# Altium schematic sheet mew-0.2.1-full-tsc.schdoc
size 341 x 243 mm
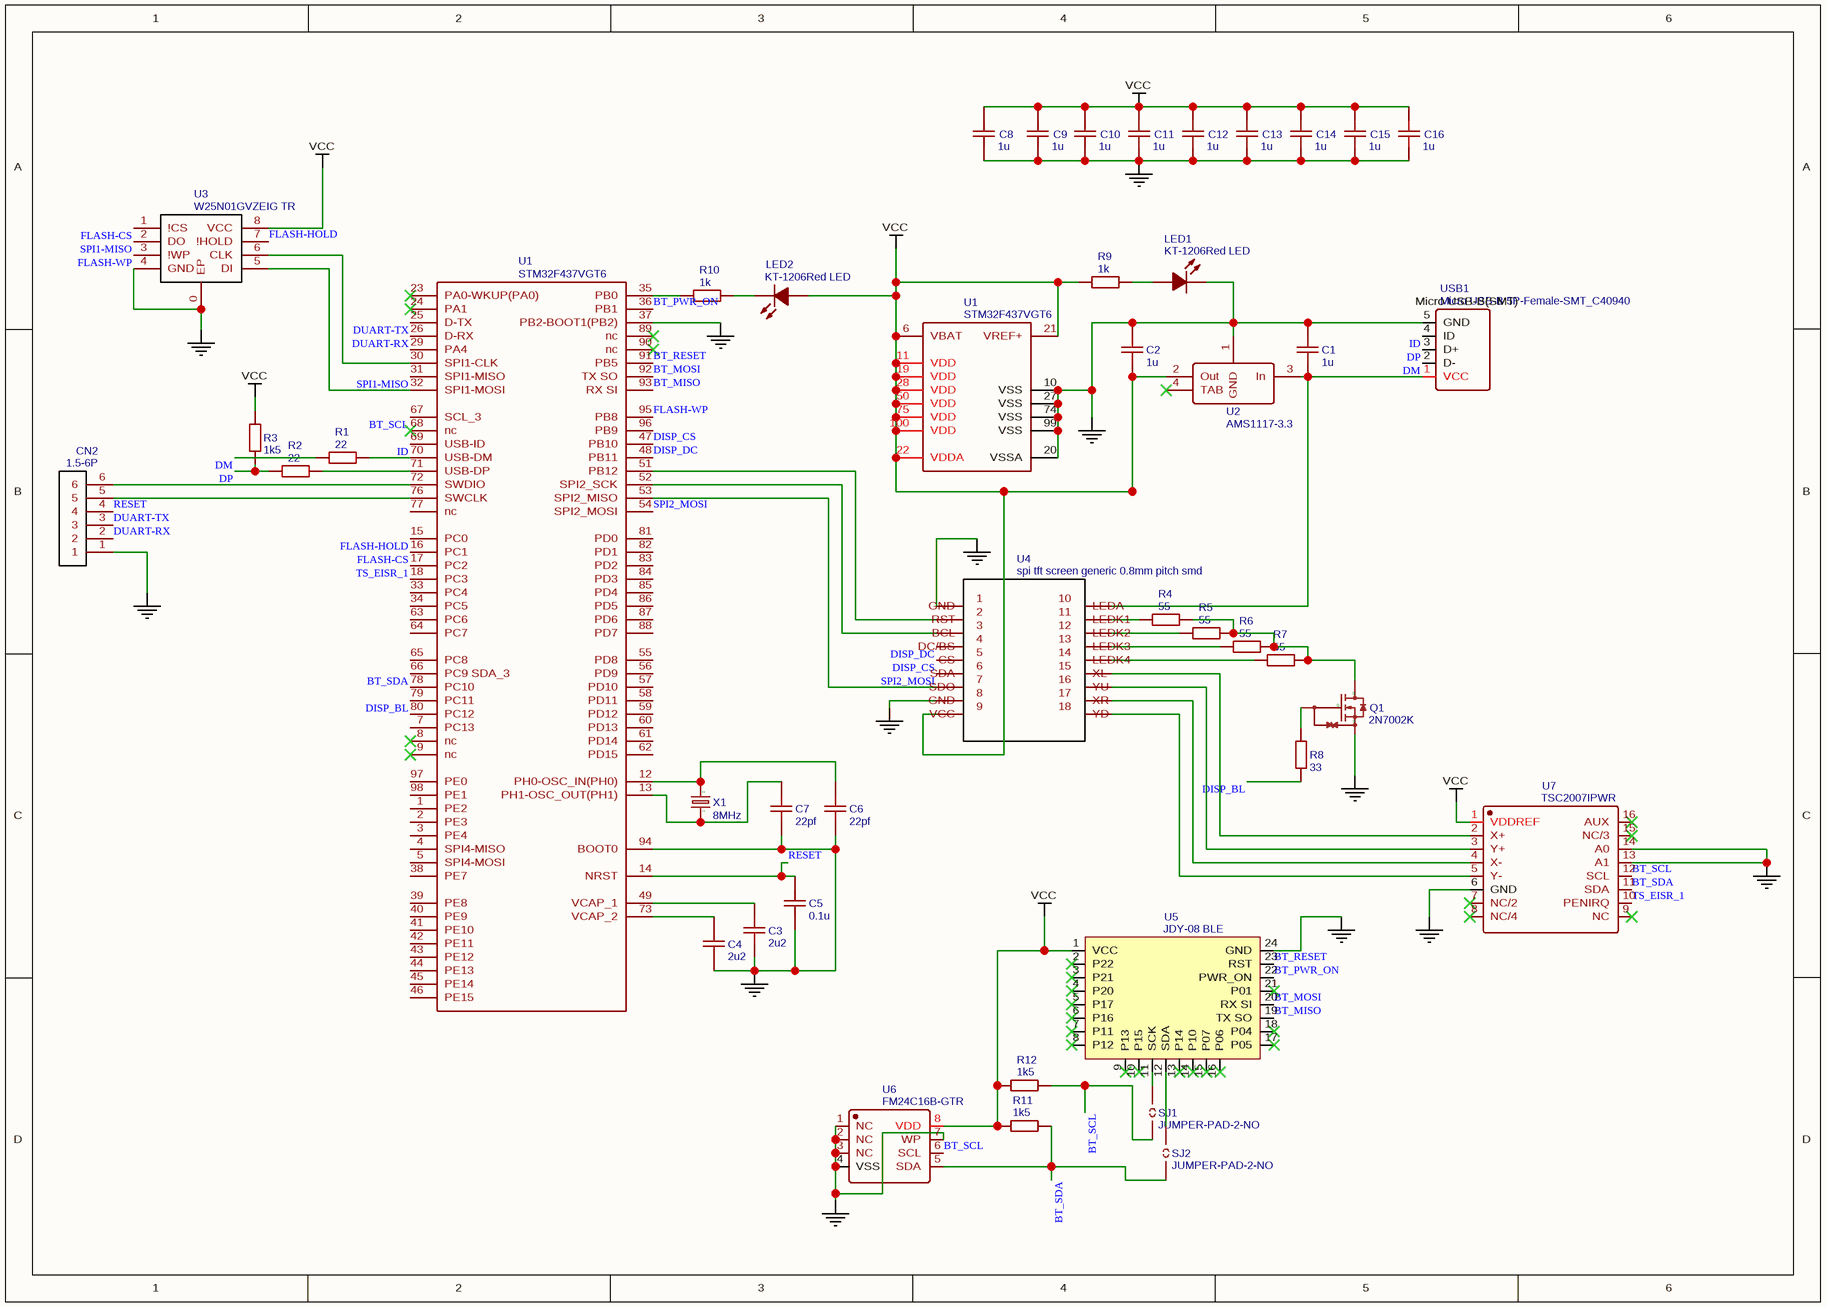
[diagram p0: mew-0.2.1-full-tsc.schdoc]

## Parts
(Parts that share a designator on the sheet are numbered #1, #2 ... from top to bottom, then left to right.)
C1  1u  [0603]
C2  1u  [0603]
C3  2u2  [0603]
C4  2u2  [0603]
C5  0.1u  [0603]
C6  22pf  [0603]
C7  22pf  [0603]
C8  1u  [0603]
C9  1u  [0603]
C10  1u  [0603]
C11  1u  [0603]
C12  1u  [0603]
C13  1u  [0603]
C14  1u  [0603]
C15  1u  [0603]
C16  1u  [0603]
CN2  1.5-6P  [1.5T-6P]
LED1  KT-1206Red LED  [LED-1206]
LED2  KT-1206Red LED  [LED-1206]
Q1  2N7002K  [SOT-23(SOT-23-3)]
R1  22  [0603]
R2  22  [0603]
R3  1k5  [0603]
R4  55  [0603]
R5  55  [0603]
R6  55  [0603]
R7  55  [0603]
R8  33  [0603]
R9  1k  [0603]
R10  1k  [0603]
R11  1k5  [0603]
R12  1k5  [0603]
SJ1  JUMPER-PAD-2-NO  [PAD-JUMPER-2-NO_NO_SILK]
SJ2  JUMPER-PAD-2-NO  [PAD-JUMPER-2-NO_NO_SILK]
U1#1  STM32F437VGT6  [STM-LQFP100]
U1#2  STM32F437VGT6  [STM-LQFP100]
U2  AMS1117-3.3  [SOT-223]
U3  W25N01GVZEIG TR  [WSON-8X6]
U4  spi tft screen generic 0.8mm pitch smd  [SMD TFT 18PIN 0.8MM]
U5  JDY-08 BLE  [JDY-08_HANDSOLDERING]
U6  FM24C16B-GTR  [SOIC-8_150MIL]
U7  TSC2007IPWR  [TSSOP-16]
USB1  Micro USB-B 5P-Female-SMT_C40940  [MICRO 5P_C40940]
X1  8MHz  [5032]

## Nets
GND: C1.2 C2.2 C3.1 C4.1 C5.1 C6.1 C7.1 C8.1 C9.1 C10.1 C11.1 C12.1 C13.1 C14.1 C15.1 C16.1 CN2.1 LED1.2(K) Q1.2(S) U1#1.10(VSS) U1#1.20(VSSA) U1#1.27(VSS) U1#1.74(VSS) U1#1.99(VSS) U1#2.37(PB2-BOOT1(PB2)) U1#2.94(BOOT0) U2.1(GND) U3.0(EP) U3.4(GND) U4.1(GND) U4.8(GND) U5.24(GND) U6.1(NC) U6.2(NC) U6.3(NC) U6.4(VSS) U6.7(WP) U7.6(GND) U7.13(A1) U7.14(A0) USB1.5(GND)
VCC: C2.1 C8.2 C9.2 C10.2 C11.2 C12.2 C13.2 C14.2 C15.2 C16.2 LED2.1(A) R3.2 R9.1 R11.2 R12.1 U1#1.6(VBAT) U1#1.11(VDD) U1#1.19(VDD) U1#1.21(VREF+) U1#1.22(VDDA) U1#1.28(VDD) U1#1.50(VDD) U1#1.75(VDD) U1#1.100(VDD) U2.2(Out) U3.8(VCC) U4.9(VCC) U5.1(VCC) U6.8(VDD) U7.1(VDDREF)
BT_MISO: U1#2.93(RX_SI) U5.19(TX_SO)
BT_MOSI: U1#2.92(TX_SO) U5.20(RX_SI)
BT_PWR_ON: U1#2.36(PB1) U5.22(PWR_ON)
BT_RESET: U1#2.91(PB5) U5.23(RST)
BT_SCL: R12.2 SJ1.1 U1#2.67(SCL_3) U6.6(SCL) U7.12(SCL)
BT_SDA: R11.1 SJ2.1 U1#2.66(PC9_SDA_3) U6.5(SDA) U7.11(SDA)
DISP_BL: R8.1 U1#2.79(PC11)
DISP_CS: U1#2.47(PB10) U4.5(CS)
DISP_DC: U1#2.48(PB11) U4.4(DC/BS)
DM: R1.1 USB1.2(D-)
DP: R2.1 R3.1 USB1.3(D+)
DUART-RX: CN2.2 U1#2.26(D-RX)
DUART-TX: CN2.3 U1#2.25(D-TX)
FLASH-CS: U1#2.16(PC1) U3.1(!CS)
FLASH-HOLD: U1#2.15(PC0) U3.7(!HOLD)
FLASH-WP: U1#2.95(PB8) U3.3(!WP)
ID: U1#2.69(USB-ID) USB1.4(ID)
RESET: C5.2 CN2.4 U1#2.14(NRST)
SPI1-MISO: U1#2.31(SPI1-MISO) U3.2(DO)
SPI2_MOSI: U1#2.54(SPI2_MOSI) U4.6(SDA)
TS_EISR_1: U1#2.17(PC2) U7.10(PENIRQ)
NetC1_1: C1.1 U2.3(In) U4.10(LEDA) USB1.1(VCC)
NetC3_2: C3.2 U1#2.49(VCAP_1)
NetC4_2: C4.2 U1#2.73(VCAP_2)
NetC6_2: C6.2 U1#2.12(PH0-OSC_IN(PH0)) X1.2
NetC7_2: C7.2 U1#2.13(PH1-OSC_OUT(PH1)) X1.1
NetCN2_5: CN2.5 U1#2.76(SWCLK)
NetCN2_6: CN2.6 U1#2.72(SWDIO)
NetLED1_1: LED1.1(A) R9.2
NetLED2_2: LED2.2(K) R10.2
NetQ1_1: Q1.1(G) R8.2
NetQ1_3: Q1.3(D) R4.2 R5.2 R6.2 R7.2
NetR1_2: R1.2 U1#2.70(USB-DM)
NetR2_2: R2.2 U1#2.71(USB-DP)
NetR4_1: R4.1 U4.11(LEDK1)
NetR5_1: R5.1 U4.12(LEDK2)
NetR6_1: R6.1 U4.13(LEDK3)
NetR7_1: R7.1 U4.14(LEDK4)
NetR10_1: R10.1 U1#2.35(PB0)
NetSJ1_2: SJ1.2 U5.11(SCK)
NetSJ2_2: SJ2.2 U5.12(SDA)
NetU1#2_30: U1#2.30(SPI1-CLK) U3.6(CLK)
NetU1#2_32: U1#2.32(SPI1-MOSI) U3.5(DI)
NetU1#2_51: U1#2.51(PB12) U4.2(RST)
NetU1#2_52: U1#2.52(SPI2_SCK) U4.3(BCL)
NetU1#2_53: U1#2.53(SPI2_MISO) U4.7(SDO)
NetU4_15: U4.15(XL) U7.2(X+)
NetU4_16: U4.16(YU) U7.3(Y+)
NetU4_17: U4.17(XR) U7.4(X-)
NetU4_18: U4.18(YD) U7.5(Y-)

Not connected (* = marked no-connect by the designer): U1#2 1(PE2) 2(PE3) 3(PE4) 4(SPI4-MISO) 5(SPI4-MOSI) 7(PC13) 8(nc)* 9(nc)* 18(PC3) 23(PA0-WKUP(PA0))* 24(PA1)* 29(PA4) 33(PC4) 34(PC5) 38(PE7) 39(PE8) 40(PE9) 41(PE10) 42(PE11) 43(PE12) 44(PE13) 45(PE14) 46(PE15) 55(PD8) 56(PD9) 57(PD10) 58(PD11) 59(PD12) 60(PD13) 61(PD14) 62(PD15) 63(PC6) 64(PC7) 65(PC8) 68(nc)* 77(nc) 78(PC10) 80(PC12) 81(PD0) 82(PD1) 83(PD2) 84(PD3) 85(PD4) 86(PD5) 87(PD6) 88(PD7) 89(nc)* 90(nc)* 96(PB9) 97(PE0) 98(PE1); U2 4(TAB)*; U5 2(P22)* 3(P21)* 4(P20)* 5(P17)* 6(P16)* 7(P11)* 8(P12)* 9(P13)* 10(P15)* 13(P14)* 14(P10)* 15(P07)* 16(P06)* 17(P05)* 18(P04)* 21(P01)*; U7 7(NC/2)* 8(NC/4)* 9(NC)* 15(NC/3)* 16(AUX)*

## Notes on the sheet
- (in symbol USB1) Micro USB-B(SMT)

## Library data of the parts
C1 C2 C8-C16 = (no symbol name): BOM_Manufacturer Part: 0603B105K160; BOM_Manufacturer: WTC; nameAlias: Value(F); spicePre: C; spiceSymbolName: Cap_RAD-0.1_US; BOM_Supplier: LCSC; BOM_Supplier Part: C108463
C3 C4 = (no symbol name): BOM_Manufacturer Part: GRM188B31A225KE33D; BOM_Manufacturer: MuRata; nameAlias: Value(F); spicePre: C; spiceSymbolName: Cap_RAD-0.1_US; BOM_Supplier: LCSC; BOM_Supplier Part: C85991
C5 = (no symbol name): BOM_Manufacturer Part: 06033C104KAT2A; BOM_Manufacturer: AVX; nameAlias: Value(F); spicePre: C; spiceSymbolName: Cap_RAD-0.1_US; BOM_Supplier: LCSC; BOM_Supplier Part: C143640
C6 C7 = (no symbol name): BOM_Manufacturer Part: GCM1885C1H220JA16D; BOM_Manufacturer: MuRata; nameAlias: Value(F); spicePre: C; spiceSymbolName: Cap_RAD-0.1_US; BOM_Supplier: LCSC; BOM_Supplier Part: C126555
CN2 = (no symbol name): BOM_Manufacturer: BOOMELE; Contributor: LCSC; BOM_Supplier: LCSC; BOM_Manufacturer Part: 1.5-6P; spicePre: C; BOM_Supplier Part: C58553
LED1 LED2 = (no symbol name): BOM_Manufacturer: KENTO; Contributor: LCSC; BOM_Supplier: LCSC; BOM_Manufacturer Part: KT-1206Red LED; image: //image.lceda.cn/szlcsc/C49018.jpg; spicePre: L; BOM_Supplier Part: C49018
Q1 = (no symbol name): BOM_Manufacturer: FMS; Contributor: LCSC; BOM_Supplier: LCSC; BOM_Manufacturer Part: 2N7002K; spicePre: Q; BOM_Supplier Part: C163140
R1 R2 = (no symbol name): BOM_Manufacturer Part: 0603WAF221JT5E; BOM_Manufacturer: UniOhm; nameAlias: Value(Ω); spicePre: R; spiceSymbolName: Res_AXIAL-0.3(1/8W)_EU; BOM_Supplier: LCSC; BOM_Supplier Part: C22958
R3 = (no symbol name): BOM_Manufacturer Part: CBG160808U152T; BOM_Manufacturer: FH; nameAlias: Value(Ω); spicePre: R; spiceSymbolName: Res_AXIAL-0.3(1/8W)_EU; BOM_Supplier: LCSC; BOM_Supplier Part: C98503
R4-R7 R11 R12 = (no symbol name): BOM_Manufacturer Part: CBG160808U501; BOM_Manufacturer: FH; nameAlias: Value(Ω); spicePre: R; spiceSymbolName: Res_AXIAL-0.3(1/8W)_EU; BOM_Supplier: LCSC; BOM_Supplier Part: C87649
R8 = (no symbol name): BOM_Manufacturer Part: CBW160808U330T; BOM_Manufacturer: FH; nameAlias: Value(Ω); spicePre: R; spiceSymbolName: Res_AXIAL-0.3(1/8W)_EU; BOM_Supplier: LCSC; BOM_Supplier Part: C139180
R9 R10 = (no symbol name): BOM_Manufacturer Part: WR06X102JTL; BOM_Manufacturer: WTC; nameAlias: Value(Ω); spicePre: R; spiceSymbolName: Res_AXIAL-0.3(1/8W)_EU; BOM_Supplier: LCSC; BOM_Supplier Part: C112407
SJ1 SJ2 = (no symbol name): Contributor: SparkFun; BOM_Manufacturer Part: ?; spicePre: S
U1#1 = (no symbol name): subpart_no: 1; description: ARM Cortex-M4 32-bit MCU+FPU, 210 DMIPS, 1024 kB Flash, 256 kB Internal RAM, 82 IOs, 100-pin LQFP, -40 to 85 degC, Tray; BOM_Manufacturer Part: ?; spicePre: U
U1#2 = (no symbol name): subpart_no: 2; description: ARM Cortex-M4 32-bit MCU+FPU, 210 DMIPS, 1024 kB Flash, 256 kB Internal RAM, 82 IOs, 100-pin LQFP, -40 to 85 degC, Tray; BOM_Manufacturer Part: ?; spicePre: U
U2 = (no symbol name): BOM_Manufacturer: AMS; sourceId: dwIGgezVh; Contributor: LCSC; timeStamp: 1476261164; BOM_Supplier: LCSC; BOM_Manufacturer Part: AMS1117-3.3; BOM_LCSC Assembly: Yes; image: //image.lceda.cn/szlcsc/C6186.jpg; spicePre: U; BOM_Supplier Part: C6186
U3 = (no symbol name): BOM_Manufacturer: Winbond; Contributor: kdavies4; BOM_Manufacturer Part: W25N01GVZEIG TR; BOM_Supplier: Digi-Key; link: https://www.winbond.com/resource-files/w25n01gv%20revg%20032116.pdf; spicePre: U; BOM_Supplier Part: W25N01GVZEIGCT-ND
U4 = (no symbol name): Contributor: abrugsch; BOM_Manufacturer Part: spi tft screen generic 0.8mm pitch smd; spicePre: U
U5 = (no symbol name): description: JDY-08 BLE Bluetooth 4.0 Uart Transceiver Module CC2541 Central Switching Wireless Module iBeacon; BOM_Manufacturer Part: ?; spicePre: U
U6 = (no symbol name): BOM_Manufacturer: CYPRESS; Contributor: LCSC; BOM_Supplier: LCSC; BOM_Manufacturer Part: FM24C16B-GTR; spicePre: U; BOM_Supplier Part: C66016
U7 = (no symbol name): BOM_Manufacturer: TI; Contributor: LCSC; BOM_Supplier: LCSC; BOM_Manufacturer Part: TSC2007IPWR; image: //image.lceda.cn/szlcsc/C38398.jpg; spicePre: U; BOM_Supplier Part: C38398
USB1 = (no symbol name): BOM_Manufacturer: ValuePro; Contributor: LCSC; BOM_Supplier: LCSC; BOM_Manufacturer Part: Micro USB-B 5P-Female-SMT; image: //image.lceda.cn/szlcsc/C40940.jpg; spicePre: U; BOM_Supplier Part: C40940
X1 = (no symbol name): BOM_Manufacturer Part: ?; spicePre: X